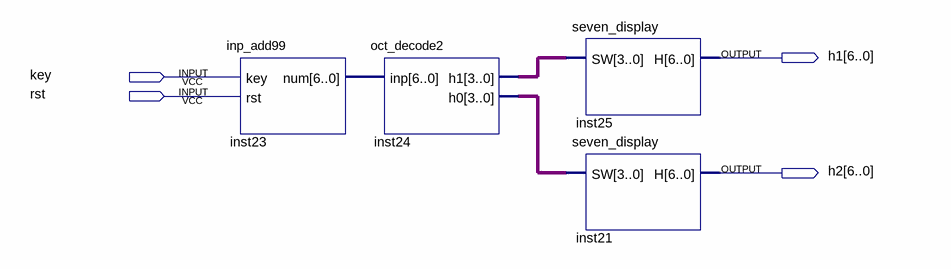
[diagram p0: schematic sheet]
// Quartus schematic enter_count.bdf as structural Verilog: 4 symbols, 4 pins
module enter_count (
  input  key,
  input  rst,
  output [6:0] h1,
  output [6:0] h2
);

  wire [3:0] inst24_h0, inst24_h1;
  wire [6:0] inst23_num;

  inp_add99 inst23 (.key(key), .rst(rst), .num(inst23_num));
  oct_decode2 inst24 (.inp(inst23_num), .h1(inst24_h1), .h0(inst24_h0));
  seven_display inst25 (.SW(inst24_h1), .H(h1));
  seven_display inst21 (.SW(inst24_h0), .H(h2));
endmodule
